# EAGLE design max1614_bo (EAGLE 6.5.0)
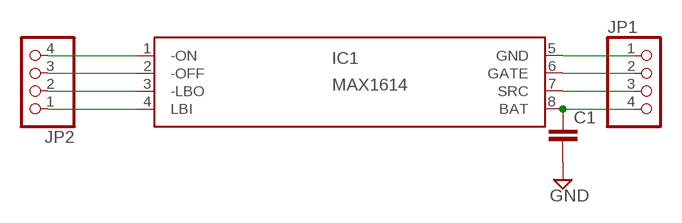
[diagram p0: schematic, sheet 1]

## Parts
C1  C-EUC0805  [C0805]
IC1  MAX1614  [UMAX8]
JP1  PINHD-1X4  [1X04]
JP2  PINHD-1X4  [1X04]

## Nets
-LBO: IC1.3(-LBO) JP2.2
-OFF: IC1.2(-OFF) JP2.3
-ON: IC1.1(-ON) JP2.4
BAT: C1.1 IC1.8(BAT) JP1.4
GATE: IC1.6(GATE) JP1.2
GND: C1.2 IC1.5(GND) JP1.1
LBI: IC1.4(LBI) JP2.1
SRC: IC1.7(SRC) JP1.3

## Library data of the parts
C1 = rcl:C-EU: CAPACITOR, European symbol
IC1 = max1614:MAX1614: edit this description Auto generated by make-symbol-device-package-bsdl.ulp Rev. 43 Source:
JP1 JP2 = pinhead:PINHD-1X4: PIN HEADER

## Board
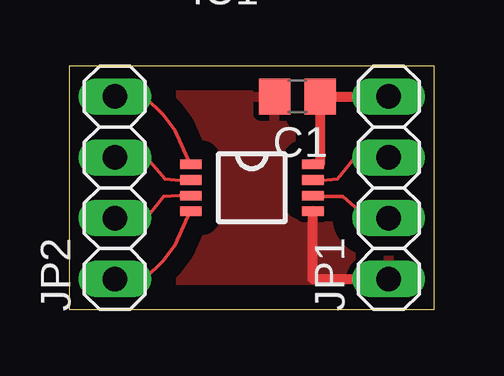
[diagram p1: board, top side]

Size 15.24 x 10.16 mm. Coordinates in mm from the lower left corner, seen from the top.
Outline: 0,0 15.24,0 15.24,10.16 0,10.16 0,0
Copper layers 1: Top 0.035mm
Design rules "1l": minimum track width 6mil, minimum drill 24mil, track to track 8mil, track to pad 8mil, pad to pad 8mil, via to via 8mil, smd to smd 8mil, copper to edge 40mil, drill to drill 8mil, minimum pad ring 10mil, minimum via ring 8mil, stop-mask expansion 4mil, vias tented up to drill 0mil, thermal gap 10mil

### Footprints (pad centres in the part's own frame; a part is rotated, then mirrored left to right if it is on the bottom)
C0805 = smd 1.3 x 1.5: 1 -0.95,0; 2 0.95,0
UMAX8 = smd 0.9 x 0.4: 1 -2.55,0.975; 2 -2.55,0.325; 3 -2.55,-0.325; 4 -2.55,-0.975; 5 2.55,-0.975; 6 2.55,-0.325; 7 2.55,0.325; 8 2.55,0.975
1X04 = drill 1.016 long: 1 -3.81,0; 2 -1.27,0; 3 1.27,0; 4 3.81,0

### Placement (x,y rotation side)
C1  9.53,8.89 180 top
IC1  7.62,5.08 0 top
JP1  13.33,5.08 90 top
JP2  1.91,5.08 90 top

### Tracks (layer width: path | path; a pad name or v marks a point on that pad's centre or on a via)
-LBO
  Top 0.152: JP2.2 3.23,3.81 3.95,4.72 4.9,4.79 5.05,4.75 IC1.3
-OFF
  Top 0.152: JP2.3 3.23,6.35 4.01,5.44 4.84,5.37 5.05,5.41 IC1.2
-ON
  Top 0.152: JP2.4 3.15,8.89 3.94,8.1 4.42,7.47 5.05,6.07 IC1.1
BAT
  Top 0.152: 10.19,8.89 C1.1 10.54,8.89 | 10.19,6.07 IC1.8
  Top 0.406: 10.19,6.07 10.47,6.07 C1.1 | 10.54,8.89 JP1.4
GATE
  Top 0.152: JP1.2 12.45,3.81 11.42,4.71 10.31,4.71 10.19,4.78 IC1.6
GND
  Top 0.406: IC1.5 10.16,4.11 10.16,1.27 JP1.1
  pour Top (isolate 0.813): 0.64,10.16 0.64,0 14.61,0 14.61,10.16
LBI
  Top 0.152: JP2.1 3.15,1.27 3.94,2.06 4.42,2.69 5.05,4.09 IC1.4
SRC
  Top 0.152: JP1.3 11.91,6.35 11.19,5.44 10.34,5.37 IC1.7